# EAGLE design EstopperSchema (EAGLE 9.6.2)
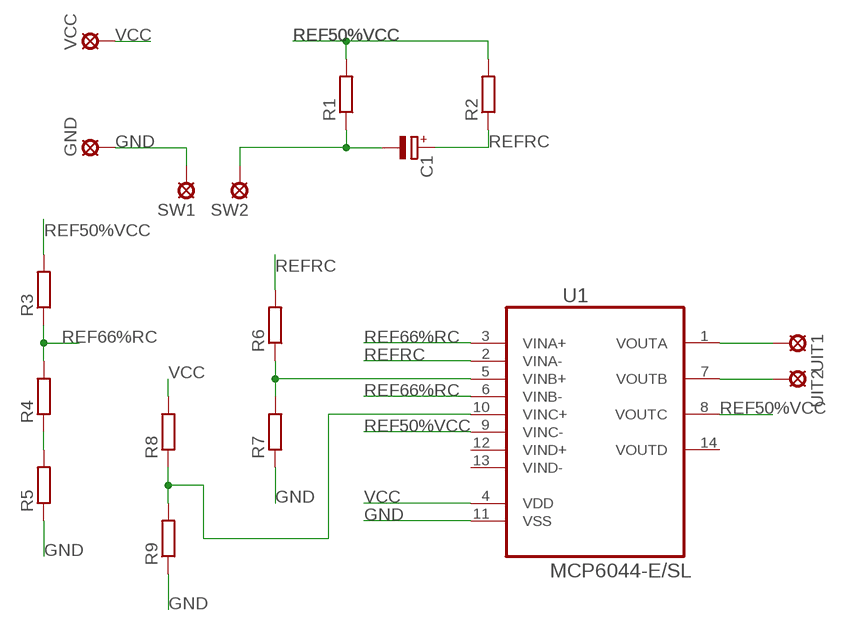
[diagram p0: schematic, sheet 1]

## Parts
C1  CPOL-EU140CLH-0810  [140CLH-0810]
GND  LSP11  [LSP11]
R1  R-EU_M1206  [M1206]
R2  R-EU_M1206  [M1206]
R3  R-EU_M1206  [M1206]
R4  R-EU_M1206  [M1206]
R5  R-EU_M1206  [M1206]
R6  R-EU_M1206  [M1206]
R7  R-EU_M1206  [M1206]
R8  R-EU_M1206  [M1206]
R9  R-EU_M1206  [M1206]
SW1  LSP11  [LSP11]
SW2  LSP11  [LSP11]
U1  MCP6044-E/SL  [SOIC127P600X175-14N]
UIT1  LSP11  [LSP11]
UIT2  LSP11  [LSP11]
VCC  LSP11  [LSP11]

## Nets
GND: GND.MP R5.1 R7.1 R9.1 SW1.MP U1.11(VSS)
N$1: R6.1 R7.2 U1.5(VINB+)
N$2: C1.- R1.1 SW2.MP
N$3: R4.1 R5.2
N$4: U1.1(VOUTA) UIT1.MP
N$5: U1.7(VOUTB) UIT2.MP
N$6: R8.1 R9.2 U1.10(VINC+)
REF50%VCC: R1.2 R2.2 R3.2 U1.8(VOUTC) U1.9(VINC-)
REF66%RC: R3.1 R4.2 U1.3(VINA+) U1.6(VINB-)
REFRC: C1.+ R2.1 R6.2 U1.2(VINA-)
VCC: R8.2 U1.4(VDD) VCC.MP
Unconnected: U1.12(VIND+) U1.13(VIND-) U1.14(VOUTD)

## Library data of the parts
C1 = rcl:CPOL-EU: POLARIZED CAPACITOR, European symbol; SPICEPREFIX: C
GND SW1 SW2 UIT1 UIT2 VCC = solpad:LSP11: SOLDER PAD drill 1.1 mm
R1-R9 = rcl:R-EU_: RESISTOR, European symbol; SPICEPREFIX: R
U1 = Microchip_By_element14_Batch_1:MCP6044-E/SL: Op-Amps; MPN: MCP6044-E/SL; OC_FARNELL: 1840864; OC_NEWARK: 56J7441; PACKAGE: SOIC14; SUPPLIER: Microchip

## Board
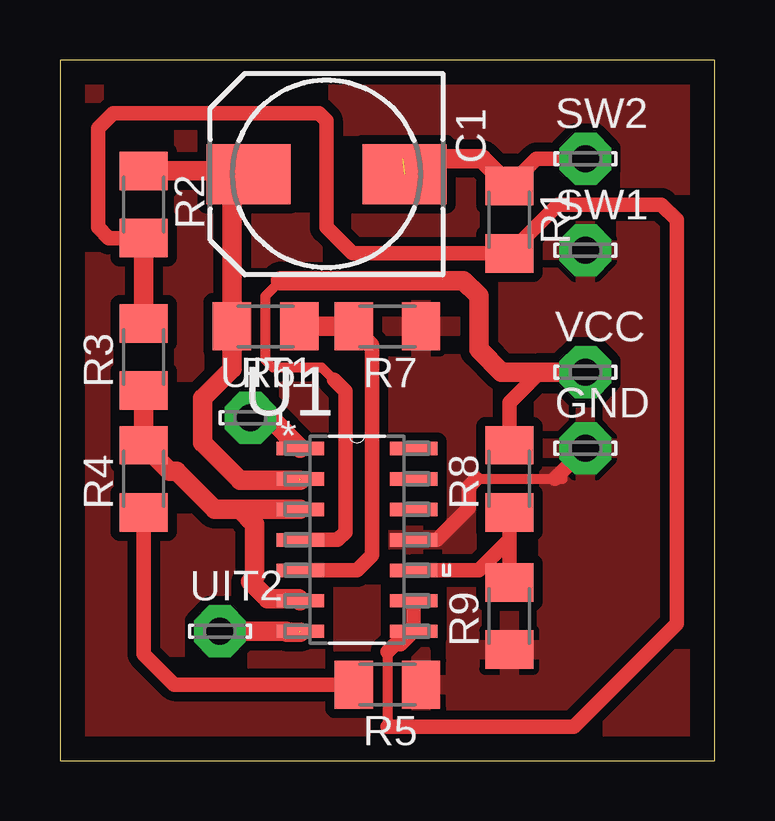
[diagram p1: board, top side]

Size 27.29 x 29.2 mm. Coordinates in mm from the lower left corner, seen from the top.
Outline: 0,0 27.29,0 27.29,29.2 0,29.2 0,0
Copper layers (1*16): Top 0.035mm / dielectric 1.5mm / Bottom 0.035mm
Design rules "default *": minimum track width 6mil, minimum drill 0.35mm, track to track 15mil, track to pad 15mil, pad to pad 15mil, via to via 15mil, smd to smd 15mil, copper to edge 40mil, drill to drill 6mil, minimum pad ring 10mil, minimum via ring 8mil, stop-mask expansion 4mil, vias tented up to drill 0mil, thermal gap 10mil

### Footprints (pad centres in the part's own frame; a part is rotated, then mirrored left to right if it is on the bottom)
140CLH-0810 = smd 3.5 x 2.5: + 3.25,0; - -3.25,0
LSP11 = drill 1.118 pad 2.159 octagon: MP 0,0
M1206 = smd 1.6 x 2: 1 -1.4,0; 2 1.4,0
SOIC127P600X175-14N = smd 1.981 x 0.559: 1 -2.362,3.81; 2 -2.362,2.54; 3 -2.362,1.27; 4 -2.362,0; 5 -2.362,-1.27; 6 -2.362,-2.54; 7 -2.362,-3.81; 8 2.362,-3.81; 9 2.362,-2.54; 10 2.362,-1.27; 11 2.362,0; 12 2.362,1.27; 13 2.362,2.54; 14 2.362,3.81

### Placement (x,y rotation side)
C1  11.11,24.45 180 top
GND  21.91,13.02 0 top
R1  18.73,22.54 270 top
R2  3.49,23.18 270 top
R3  3.49,16.83 90 top
R4  3.49,11.75 90 top
R5  13.65,3.17 180 top
R6  8.57,18.1 180 top
R7  13.65,18.1 180 top
R8  18.73,11.75 90 top
R9  18.73,6.03 90 top
SW1  21.91,21.27 0 top
SW2  21.91,25.08 0 top
U1  12.38,9.21 0 top
UIT1  7.94,14.29 0 top
UIT2  6.67,5.4 0 top
VCC  21.91,16.19 0 top

### Tracks (layer width: path | path; a pad name or v marks a point on that pad's centre or on a via)
GND
  Top 0.406: 17.36,11.75 20.64,11.75 20.95,11.75
  Top 0.61: 17.36,11.75 17.05,11.43 17.05,10.54 15.71,9.21 U1.11 | 20.64,11.75 GND.MP
  pour Top: 0,0 27.3,0 27.3,29.21 0,29.21
N$1
  Top 0.61: U1.5 12.38,7.94 13.02,8.57 13.02,17.33 R7.2
  Top 0.813: R6.1 R7.2
N$2  (1 unrouted)
  Top 0.61: R1.1 19.87,25.08 SW2.MP
  Top 0.813: R1.1 17.59,25.08 14.29,25.08
N$3
  Top 0.61: R4.1 3.49,4.45 4.76,3.17 R5.2
N$4
  Top 0.813: U1.1 8.75,14.29 UIT1.MP
N$5  (1 unrouted)
  Top 0.813: UIT2.MP 9.42,5.4 9.47,5.35 10.02,5.35
N$6
  Top 0.61: U1.10 17.46,7.94 18.73,9.21 R8.1 R9.2
REF50%VCC
  Top 0.406: 13.65,4.54 13.65,1.43
  Top 0.61: U1.9 U1.8 14.21,4.86 13.97,4.86 13.65,4.54 | R2.2 2.04,21.78 1.59,22.23 1.59,26.35 2.22,26.99 10.79,26.99 11.11,26.67 11.11,22.23 12.2,21.14 R1.2 20.77,23.18 25.08,23.18 25.72,22.54 25.72,5.71 21.43,1.43 13.65,1.43
  Top 0.813: R2.2 R3.2
REF66%RC
  Top 0.813: R3.1 R4.2 4.58,12.06 4.87,12.06 6.46,10.48 7.5,10.48 | U1.6 9.94,6.74 8.65,6.74 7.94,7.46 8.12,7.63 8.12,9.87 7.5,10.48 | U1.3 7.5,10.48
REFRC  (1 unrouted)
  Top 0.813: R2.1 7.73,24.58 C1.+ 7.17,23.76 R6.2 7.17,16.34 5.94,15.11 5.94,13.26 7.51,11.7 10.02,11.7
VCC
  Top 0.406: 11.43,15.88 10.92,16.39 8.88,16.39 8.57,16.69 8.57,19.37 9.21,20
  Top 0.61: U1.4 11.58,9.21 11.9,9.53 11.9,15.4 11.43,15.88 | R8.2 18.73,14.92 20,16.19
  Top 0.813: 20.64,16.19 VCC.MP 20,16.19 18.41,16.19 17.46,17.14 17.46,19.37 16.83,20 9.21,20